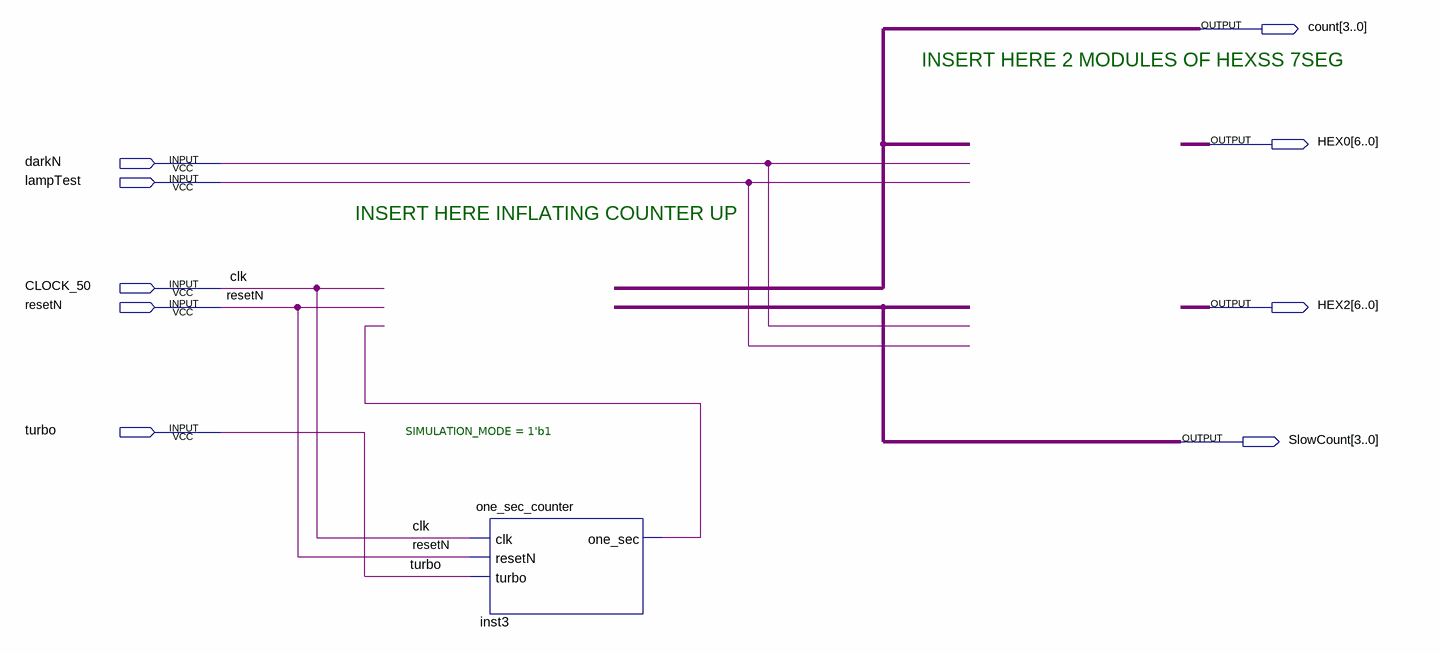
[diagram p0: schematic sheet]
// Quartus schematic inflating_cnt_top.bdf as structural Verilog: 1 symbols, 9 pins
module inflating_cnt_top (
  input  darkN,
  input  lampTest,
  input  CLOCK_50,
  input  resetN,
  input  turbo,
  output [3:0] count,
  output [6:0] HEX0,
  output [6:0] HEX2,
  output [3:0] SlowCount
);

  wire inst3_one_sec;

  one_sec_counter #(.SIMULATION_MODE(1'b1)) inst3 (
    .clk(CLOCK_50), .resetN(resetN), .turbo(turbo), .one_sec(inst3_one_sec));

  // Other names for the same wires on the sheet: clk = CLOCK_50

  // Notes on the sheet:
  //   INSERT HERE 2 MODULES OF HEXSS 7SEG
  //   INSERT HERE INFLATING COUNTER UP
endmodule
